# EAGLE design CPN v1 (EAGLE 9.5.0)
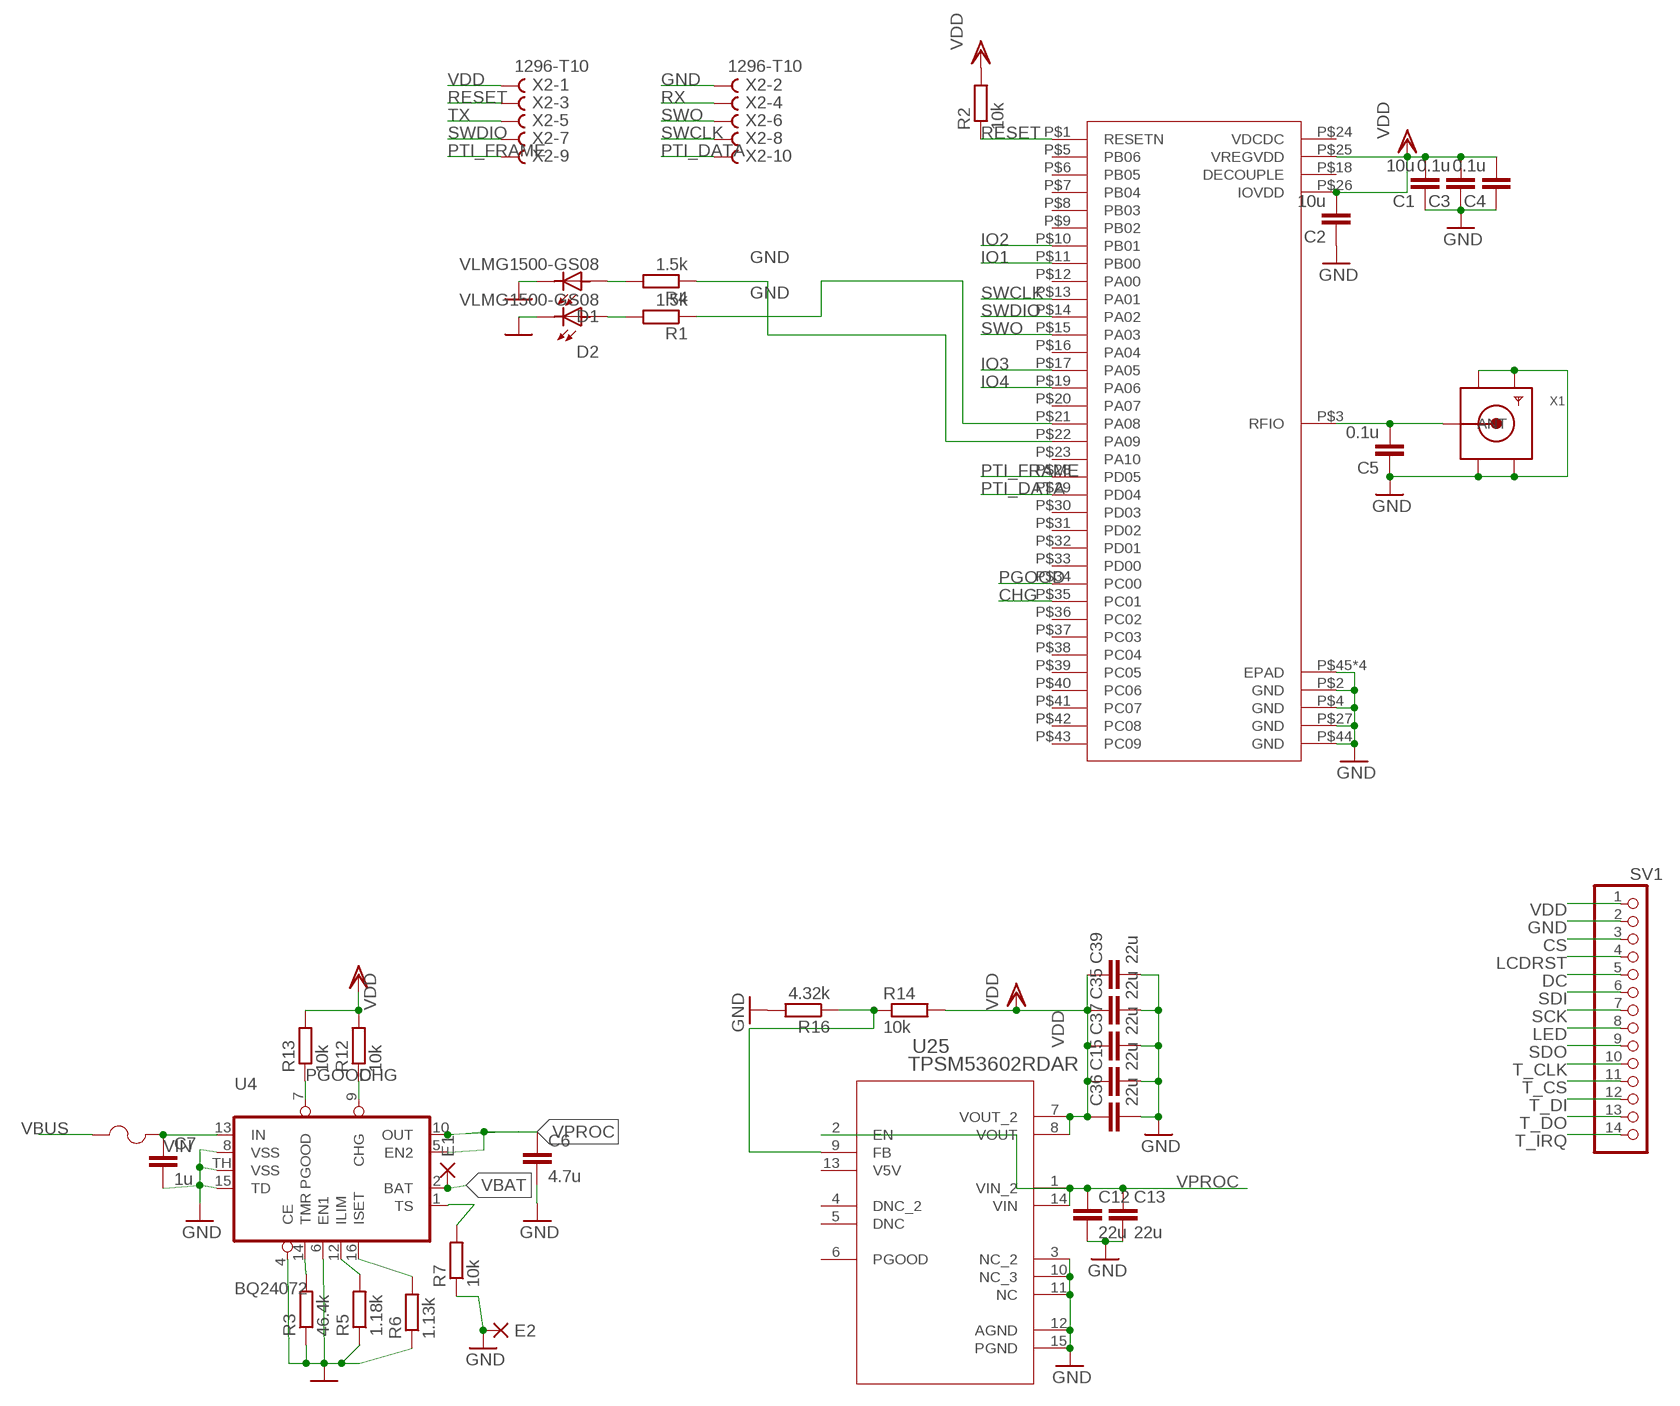
[diagram p0: schematic, sheet 1, part 1 of 2]
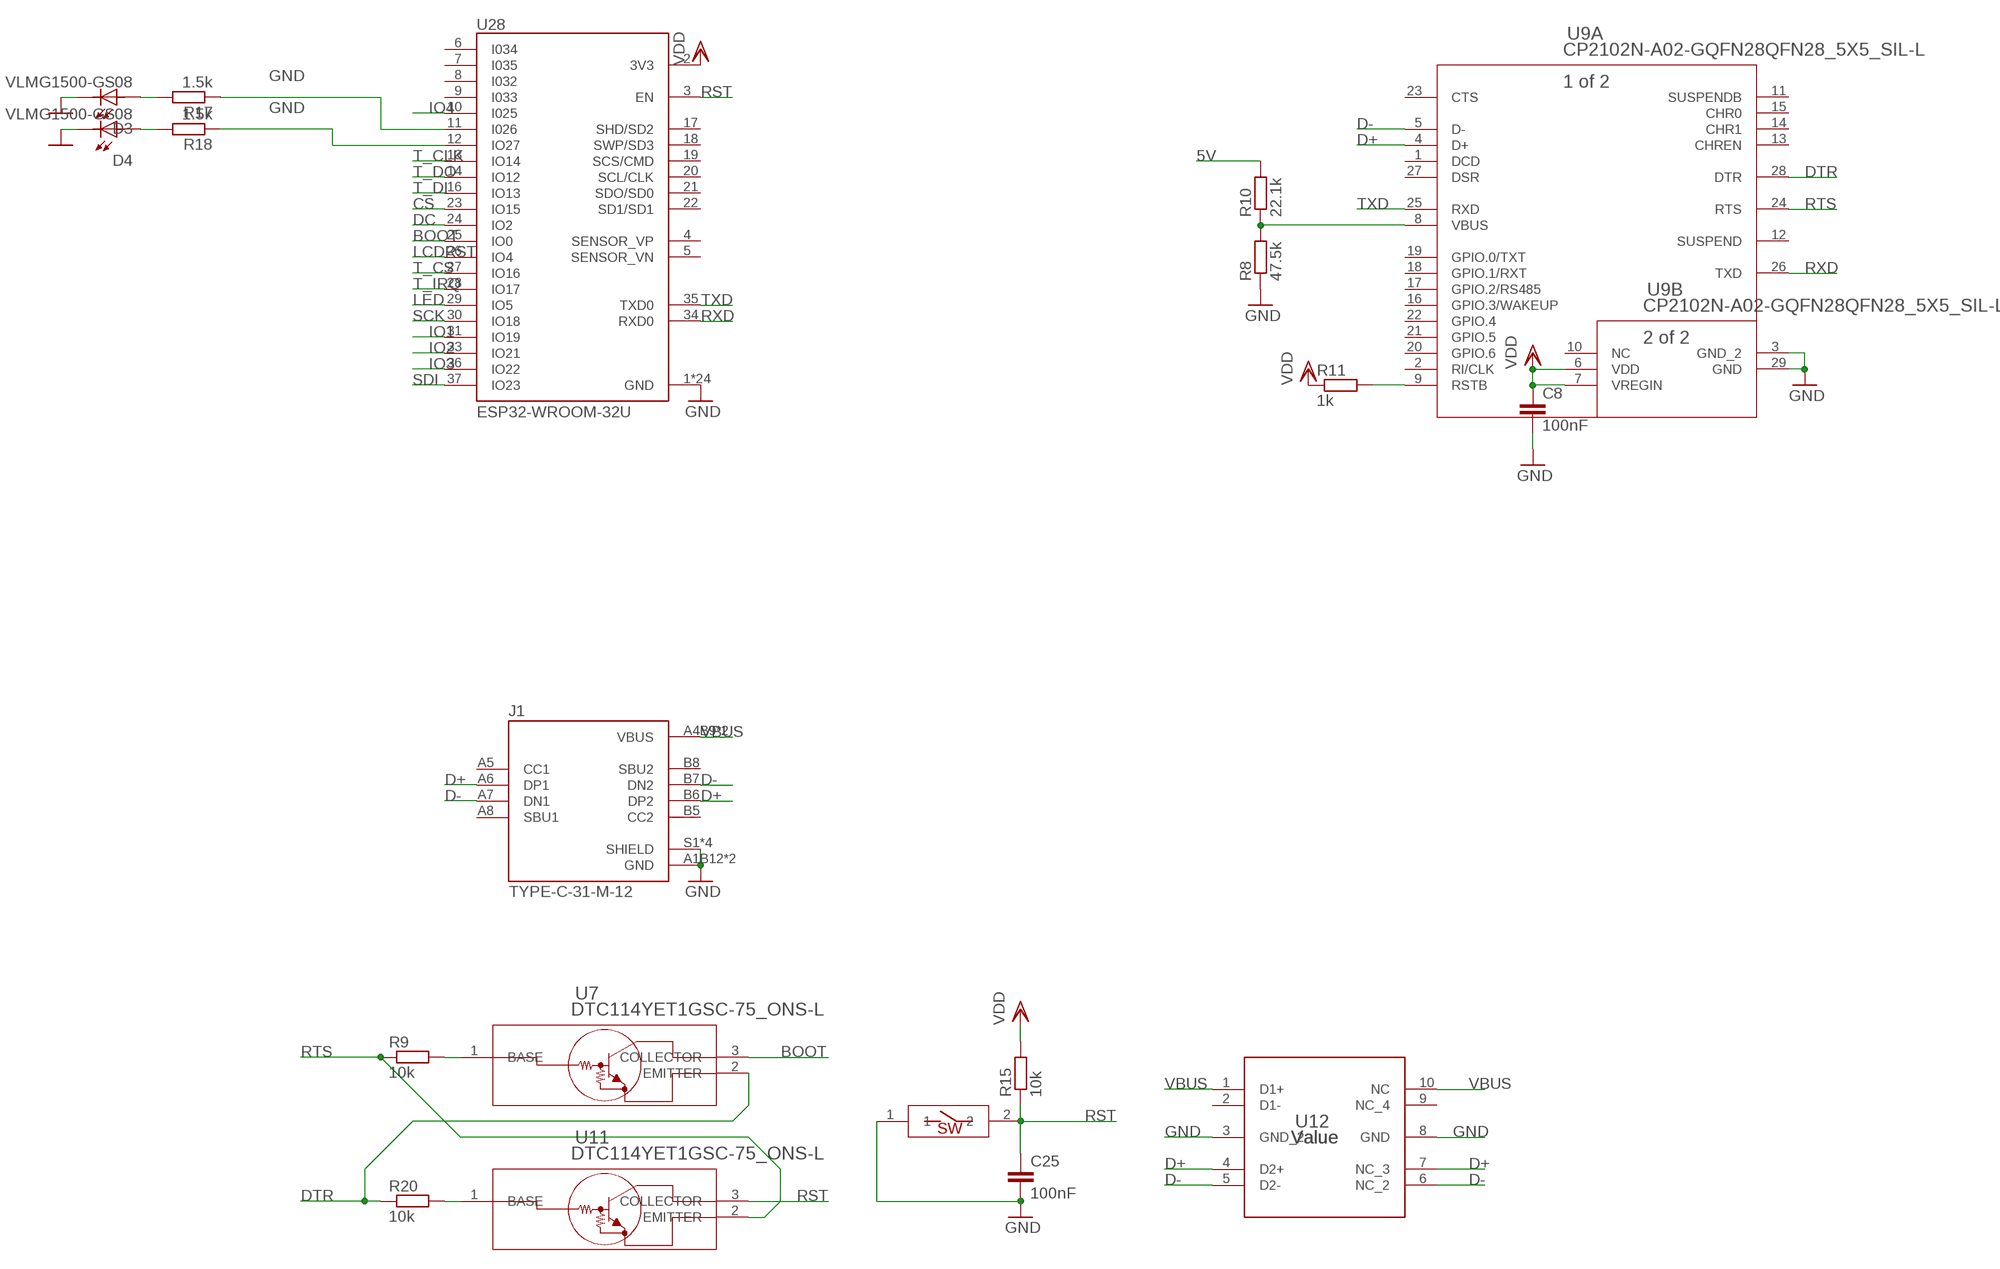
[diagram p1: schematic, sheet 1, part 2 of 2]

## Parts
C1  10u  CC0603R  [C0603R]
C2  10u  CC0603R  [C0603R]
C3  0.1u  CC0402  [C0402]
C4  0.1u  CC0402  [C0402]
C5  0.1u  CC0402  [C0402]
C6  4.7u  CC0402  [C0402]
C7  1u  CC0402  [C0402]
C8  100nF  CC0402  [C0402]
C12  22u  CC0603R  [C0603R]
C13  22u  CC0603R  [C0603R]
C15  22u  CC0603R  [C0603R]
C25  100nF  CC0402  [C0402]
C35  22u  CC0603R  [C0603R]
C36  22u  CC0603R  [C0603R]
C37  22u  CC0603R  [C0603R]
C39  22u  CC0603R  [C0603R]
D1  VLMG1500-GS08  [LEDC1005X35N]
D2  VLMG1500-GS08  [LEDC1005X35N]
D3  VLMG1500-GS08  [LEDC1005X35N]
D4  VLMG1500-GS08  [LEDC1005X35N]
E1  DPADS_PAD-0400-S  [DPADS_0400-S]
E2  DPADS_PAD-0400-S  [DPADS_0400-S]
F2  1210L050YR1210LSERIES_LTF-L  [1210LSERIES_LTF-L]
J1  TYPE-C-31-M-12  [HRO_TYPE-C-31-M-12]
R1  1.5k  RR0402  [R0402]
R2  10k  RR0402  [R0402]
R3  46.4k  RR0402  [R0402]
R4  1.5k  RR0402  [R0402]
R5  1.18k  RR0402  [R0402]
R6  1.13k  RR0402  [R0402]
R7  10k  RR0402  [R0402]
R8  47.5k  RR0402  [R0402]
R9  10k  RR0402  [R0402]
R10  22.1k  RR0402  [R0402]
R11  1k  RR0402  [R0402]
R12  10k  RR0402  [R0402]
R13  10k  RR0402  [R0402]
R14  10k  RR0402  [R0402]
R15  10k  RR0402  [R0402]
R16  4.32k  RR0402  [R0402]
R17  1.5k  RR0402  [R0402]
R18  1.5k  RR0402  [R0402]
R20  10k  RR0402  [R0402]
RESET  SMDSWITCH  [RESC4217X170]
SV1  PINHD-1X14  [1X14]
U4  BQ24072  [S-PVQFN-N16]
U7  DTC114YET1GSC-75_ONS-L  [SC-75_ONS-L]
U9  CP2102N-A02-GQFN28QFN28_5X5_SIL-L  [QFN28_5X5_SIL-L]
U11  DTC114YET1GSC-75_ONS-L  [SC-75_ONS-L]
U12  Value  ESD204DQAR  [DQA0010A]
U25  TPSM53602RDAR  [B3QFN15_RDA_TEX]
U28  ESP32-WROOM-32U  [XCVR_ESP32-WROOM-32U]
U$1  ZGM230S  [ZGM230S]
X1  SMACONNECTOR  [SMA90_DIP]
X2  1296-T10  [1296-10]

## Nets
5V: R10.2
BOOT: U7.3(COLLECTOR) U28.25(IO0)
CHG: R12.1 U4.9(CHG) U$1.P$35(PC01)
CS: SV1.3 U28.23(IO15)
D+: J1.A6(DP1) J1.B6(DP2) U9.4(A:D+) U12.4(D2+) U12.7(NC_3)
D-: J1.A7(DN1) J1.B7(DN2) U9.5(A:D-) U12.5(D2-) U12.6(NC_2)
DC: SV1.5 U28.24(IO2)
DTR: R20.1 U7.2(EMITTER) U9.28(A:DTR)
GND: C1.1 C2.1 C3.1 C4.1 C5.1 C6.2 C7.2 C8.2 C12.2 C13.2 C15.2 C25.2 C35.2 C36.2 C37.2 C39.2 D1.2 D2.2 D3.2 D4.2 E2.PAD(P) J1.A1B12(GND) J1.B1A12(GND) J1.S1(SHIELD) J1.S2(SHIELD) J1.S3(SHIELD) J1.S4(SHIELD) R3.1 R5.1 R6.1 R7.1 R8.1 R16.2 RESET.1 SV1.2 U4.4(CE) U4.6(EN1) U4.8(VSS) U4.15(TD) U4.TH(VSS) U9.3(B:GND_2) U9.29(B:GND) U12.3(GND_2) U12.8(GND) U25.3(NC_2) U25.10(NC_3) U25.11(NC) U25.12(AGND) U25.15(PGND) U28.1(GND) U28.15(GND) U28.38(GND) U28.G.1(GND) U28.G.2(GND) U28.G.4(GND) U28.G.5(GND) U28.G.6(GND) U28.G.7(GND) U28.G.8(GND) U28.G.9(GND) U28.G.10(GND) U28.G.11(GND) U28.G.12(GND) U28.G.13(GND) U28.G.14(GND) U28.G.15(GND) U28.G.16(GND) U28.G.17(GND) U28.G.18(GND) U28.G.19(GND) U28.G.20(GND) U28.G.21(GND) U28.G.22(GND) U$1.P$2(GND) U$1.P$4(GND) U$1.P$27(GND) U$1.P$44(GND) U$1.P$45(EPAD) U$1.P$46(EPAD) U$1.P$47(EPAD) U$1.P$48(EPAD) X1.GND1 X1.GND2 X1.GND3 X1.GND4 X2.2
IO1: U28.31(IO19) U$1.P$11(PB00)
IO2: U28.33(IO21) U$1.P$10(PB01)
IO3: U28.36(IO22) U$1.P$17(PA05)
IO4: U28.10(I025) U$1.P$19(PA06)
LCDRST: SV1.4 U28.26(IO4)
LED: SV1.8 U28.29(IO5)
N$1: D2.1 R1.2
N$2: R1.1 U$1.P$21(PA08)
N$3: R4.1 U$1.P$22(PA09)
N$4: R3.2 U4.14(TMR)
N$5: C5.2 U$1.P$3(RFIO) X1.ANTENNA(ANT)
N$6: R8.2 R10.1 U9.8(A:VBUS)
N$7: D1.1 R4.2
N$8: R11.2 U9.9(A:RSTB)
N$9: D3.1 R17.2
N$10: R5.2 U4.12(ILIM)
N$11: D4.1 R18.2
N$12: R6.2 U4.16(ISET)
N$13: R18.1 U28.12(IO27)
N$14: R17.1 U28.11(I026)
N$29: R20.2 U11.1(BASE)
N$30: R9.2 U7.1(BASE)
N$91: R14.1 R16.1 U25.9(FB)
PGOOD: R13.1 U4.7(PGOOD) U$1.P$34(PC00)
PTI_DATA: U$1.P$29(PD04) X2.10
PTI_FRAME: U$1.P$28(PD05) X2.9
RESET: R2.1 U$1.P$1(RESETN) X2.3
RST: C25.1 R15.1 RESET.2 U11.3(COLLECTOR) U28.3(EN)
RTS: R9.1 U9.24(A:RTS) U11.2(EMITTER)
RX: X2.4
RXD: U9.26(A:TXD) U28.34(RXD0)
SCK: SV1.7 U28.30(IO18)
SDI: SV1.6 U28.37(IO23)
SDO: SV1.9
SWCLK: U$1.P$13(PA01) X2.8
SWDIO: U$1.P$14(PA02) X2.7
SWO: U$1.P$15(PA03) X2.6
T_CLK: SV1.10 U28.13(IO14)
T_CS: SV1.11 U28.27(IO16)
T_DI: SV1.12 U28.16(IO13)
T_DO: SV1.13 U28.14(IO12)
T_IRQ: SV1.14 U28.28(IO17)
TS: R7.2 U4.1(TS)
TX: X2.5
TXD: U9.25(A:RXD) U28.35(TXD0)
VBAT: E1.PAD(P) U4.2(BAT)
VBUS: F2.1 J1.A4B9(VBUS) J1.B4A9(VBUS) U12.1(D1+) U12.10(NC)
VDD: C1.2 C2.2 C3.2 C4.2 C8.1 C15.1 C35.1 C36.1 C37.1 C39.1 R2.2 R11.1 R12.2 R13.2 R14.2 R15.2 SV1.1 U9.6(B:VDD) U9.7(B:VREGIN) U25.7(VOUT_2) U25.8(VOUT) U28.2(3V3) U$1.P$25(VREGVDD) U$1.P$26(IOVDD) X2.1
VIN: C7.1 F2.2 U4.13(IN)
VPROC [NCLS3V7]: C6.1 C12.1 C13.1 U4.5(EN2) U4.10(OUT) U25.1(VIN_2) U25.2(EN) U25.14(VIN)
Unconnected: J1.A5(CC1) J1.A8(SBU1) J1.B5(CC2) J1.B8(SBU2) U9.1(A:DCD) U9.2(A:RI/CLK) U9.10(B:NC) U9.11(A:SUSPENDB) U9.12(A:SUSPEND) U9.13(A:CHREN) U9.14(A:CHR1) U9.15(A:CHR0) U9.16(A:GPIO.3/WAKEUP) U9.17(A:GPIO.2/RS485) U9.18(A:GPIO.1/RXT) U9.19(A:GPIO.0/TXT) U9.20(A:GPIO.6) U9.21(A:GPIO.5) U9.22(A:GPIO.4) U9.23(A:CTS) U9.27(A:DSR) U12.2(D1-) U12.9(NC_4) U25.4(DNC_2) U25.5(DNC) U25.6(PGOOD) U25.13(V5V) U28.4(SENSOR_VP) U28.5(SENSOR_VN) U28.6(I034) U28.7(I035) U28.8(I032) U28.9(I033) U28.17(SHD/SD2) U28.18(SWP/SD3) U28.19(SCS/CMD) U28.20(SCL/CLK) U28.21(SDO/SD0) U28.22(SD1/SD1) U$1.P$5(PB06) U$1.P$6(PB05) U$1.P$7(PB04) U$1.P$8(PB03) U$1.P$9(PB02) U$1.P$12(PA00) U$1.P$16(PA04) U$1.P$18(DECOUPLE) U$1.P$20(PA07) U$1.P$23(PA10) U$1.P$24(VDCDC) U$1.P$30(PD03) U$1.P$31(PD02) U$1.P$32(PD01) U$1.P$33(PD00) U$1.P$36(PC02) U$1.P$37(PC03) U$1.P$38(PC04) U$1.P$39(PC05) U$1.P$40(PC06) U$1.P$41(PC07) U$1.P$42(PC08) U$1.P$43(PC09)

## Library data of the parts
C1 C2 C12 C13 C15 C35-C37 C39 = eagle-ltspice:C: CAPACITOR, European symbol
C3-C8 C25 = eagle-ltspice:C: CAPACITOR, European symbol; SPICEMODEL: NONE; SPICEPREFIX: C
D1-D4 = VLMG1500-GS08:VLMG1500-GS08: 0402 GREEN 571nm 35MCD 65° Rectangle with Flat Top SMT LED; AVAILABILITY: Unavailable; DESCRIPTION: 0402 GREEN 571nm 35MCD 65° Rectangle with Flat Top SMT LED; MF: Vishay; MP: VLMG1500-GS08; PACKAGE: 0402 Vishay; PRICE: None
E1 E2 = 52101-101-REV-A_v16:DPADS_PAD: WIRE PAD Standard US Drill Sizes and SMD pads; BOM: EXCLUDE
F2 = 1210 FUSE:1210L050YR; BUILT_BY: EMA_UL_Team; MANUFACTURER_PART_NUMBER: 1210L050YR; SOURCELIBRARY: LittleFuse_2015-04-13; VENDOR: Littelfuse Inc
J1 = TYPE-C-31-M-12:TYPE-C-31-M-12: USB Connectors 24 Receptacle 1 8.94*7.3mm RoHS Check prices <https://pricing.snapeda.com/parts/TYPE-C-31-M-12/HRO%20Electronics%20Co.%2C%20Ltd./view-part?ref=eda>; AVAILABILITY: Not in stock; DESCRIPTION: USB Connectors 24 Receptacle 1 8.94*7.3mm RoHS; MF: HRO Electronics Co., Ltd.; MP: TYPE-C-31-M-12; PACKAGE: Package; PRICE: None
R1-R18 R20 = eagle-ltspice:R: RESISTOR, European symbol; SPICEMODEL: NONE; SPICEPREFIX: R
RESET = SMD SWITCH:SMDSWITCH
SV1 = adafruit:PINHD-1X14: PIN HEADER
U4 = Simplex-ICs:BQ24072: TI BQ24072 - Li battery charger and power path management ic
U7 U11 = DTC114YET1G:DTC114YET1G; BUILT_BY: EMA_Justin; COPYRIGHT: Copyright (C) 2018 Accelerated Designs. All rights reserved; DATASHEET: https://www.onsemi.com/pub/Collateral/DTC114Y-D.PDF; MANUFACTURER_PART_NUMBER: DTC114YET1G; SOURCELIBRARY: ON_Semiconductor_2020-01-13; VENDOR: ON Semiconductor
U9 = CP2102N:CP2102N-A02-GQFN28; BUILT_BY: EMA_Cory; COPYRIGHT: Copyright (C) 2018 Accelerated Designs. All rights reserved; DATASHEET: https://www.silabs.com/documents/public/data-sheets/cp2102n-datasheet.pdf; MANUFACTURER_PART_NUMBER: CP2102N-A02-GQFN28; SOURCELIBRARY: Silicon_Labs_2020-02-14; VENDOR: Silicon Labs
U12 = ESD204DQAR:ESD204DQAR; MANUFACTURER: Texas Instruments; PARTNUMBER: ESD204DQAR; REFDES: RefDes; TYPE: TYPE
U25 = TPSM53602:TPSM53602RDAR; BUILT_BY: EMA_Cory; COPYRIGHT: Copyright (C) 2018 Accelerated Designs. All rights reserved; DATASHEET: https://www.ti.com/lit/ds/symlink/tpsm53602.pdf?ts=1593032137197&ref_url=https%253A%252F%252Fwww.ti.com%252Fstore%252Fti%252Fen%252Fp%252Fproduct%252F%253Fp%253DTPSM53602RDAR; MANUFACTURER_PART_NUMBER: TPSM53602RDAR; SOURCELIBRARY: TI_2020-06-27; VENDOR: Texas Instruments
U28 = ESP32-WROOM-32U:ESP32-WROOM-32U: Wi-Fi/BT BLE Module ESP32-D0WD SPI Flash UART U.FL Conn. Check prices <https://pricing.snapeda.com/parts/ESP32-WROOM-32U/Espressif%20Systems/view-part?ref=eda>; AVAILABILITY: In Stock; DESCRIPTION: Bluetooth, WiFi 802.11b/g/n, Bluetooth v4.2 +EDR, Class 1, 2 and 3 Transceiver Module 2.4GHz ~ 2.5GHz Antenna Not Included, U.FL Surface Mount; MF: Espressif Systems; MP: ESP32-WROOM-32U; PACKAGE: Module Espressif Systems; PRICE: None; PURCHASE-URL: https://pricing.snapeda.com/search/part/ESP32-WROOM-32U/?ref=eda
U$1 = ZGM230S:ZGM230S
X1 = adafruit:SMACONNECTOR: SMA Connector 90° DIP SMA Connector, 50 Ohm (4UConnector: 07259)
X2 = con-leotronics:1296-T10: 1.27mm SINGLE ROW FEMALE SOCKET Source: http://www.leotronics.co.uk/Conexcon/Data%20Sheets/sec.%20A/1296ing.pdf; OC_FARNELL: unknown; OC_NEWARK: unknown

## Net classes
2 NCLS3V7: width 0.178 mm, drill 0.178 mm, clearance 0.178 mm

## Board
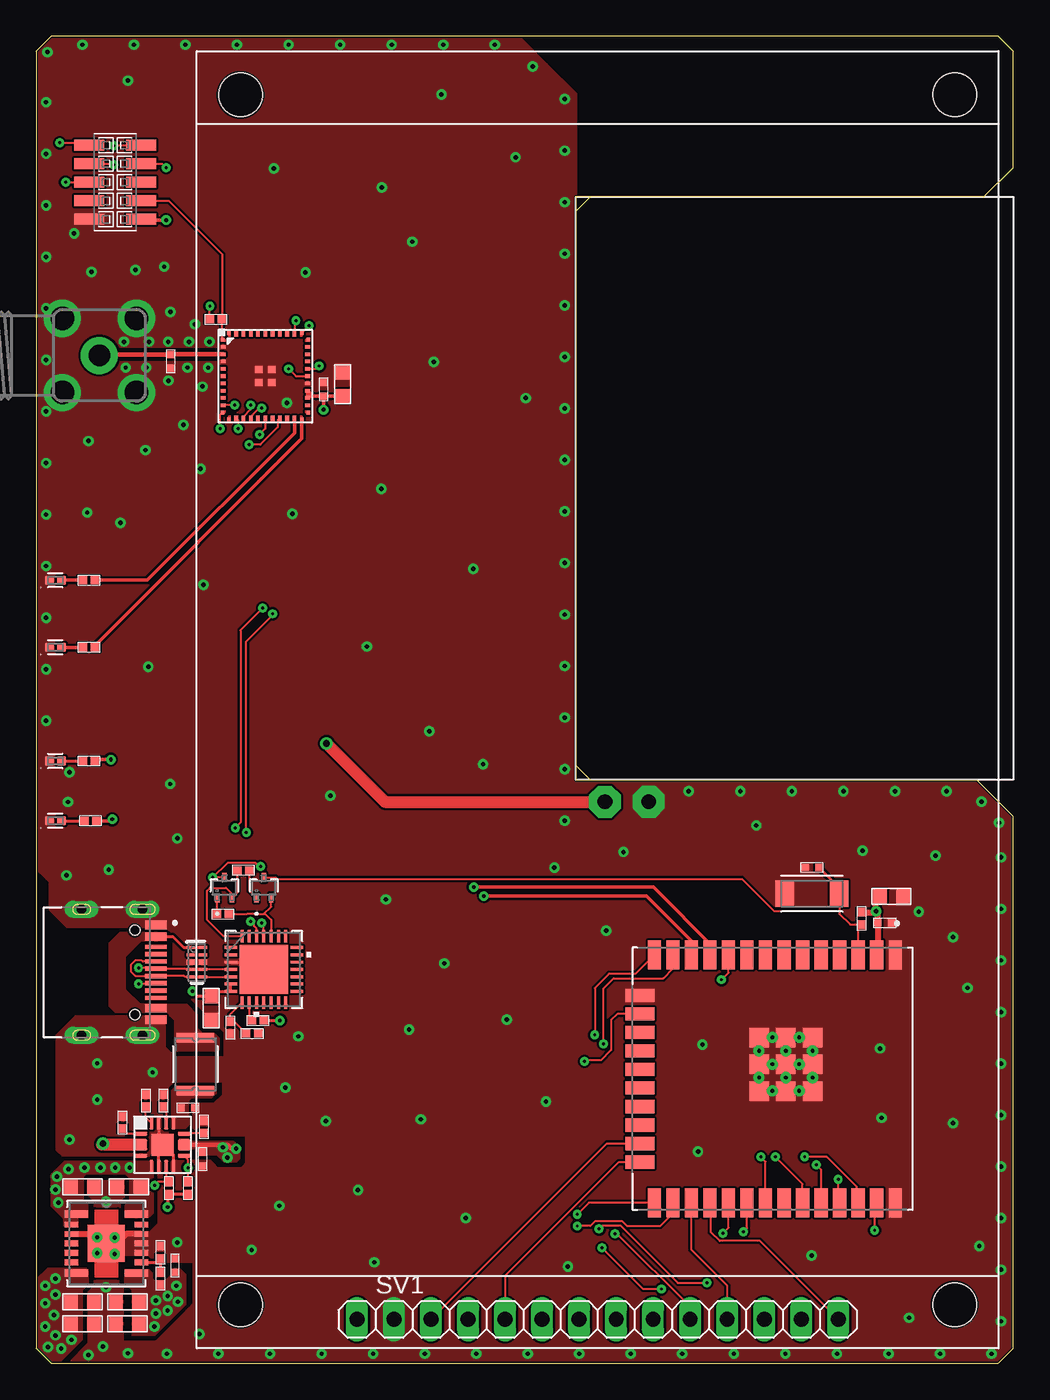
[diagram p2: board, top side]
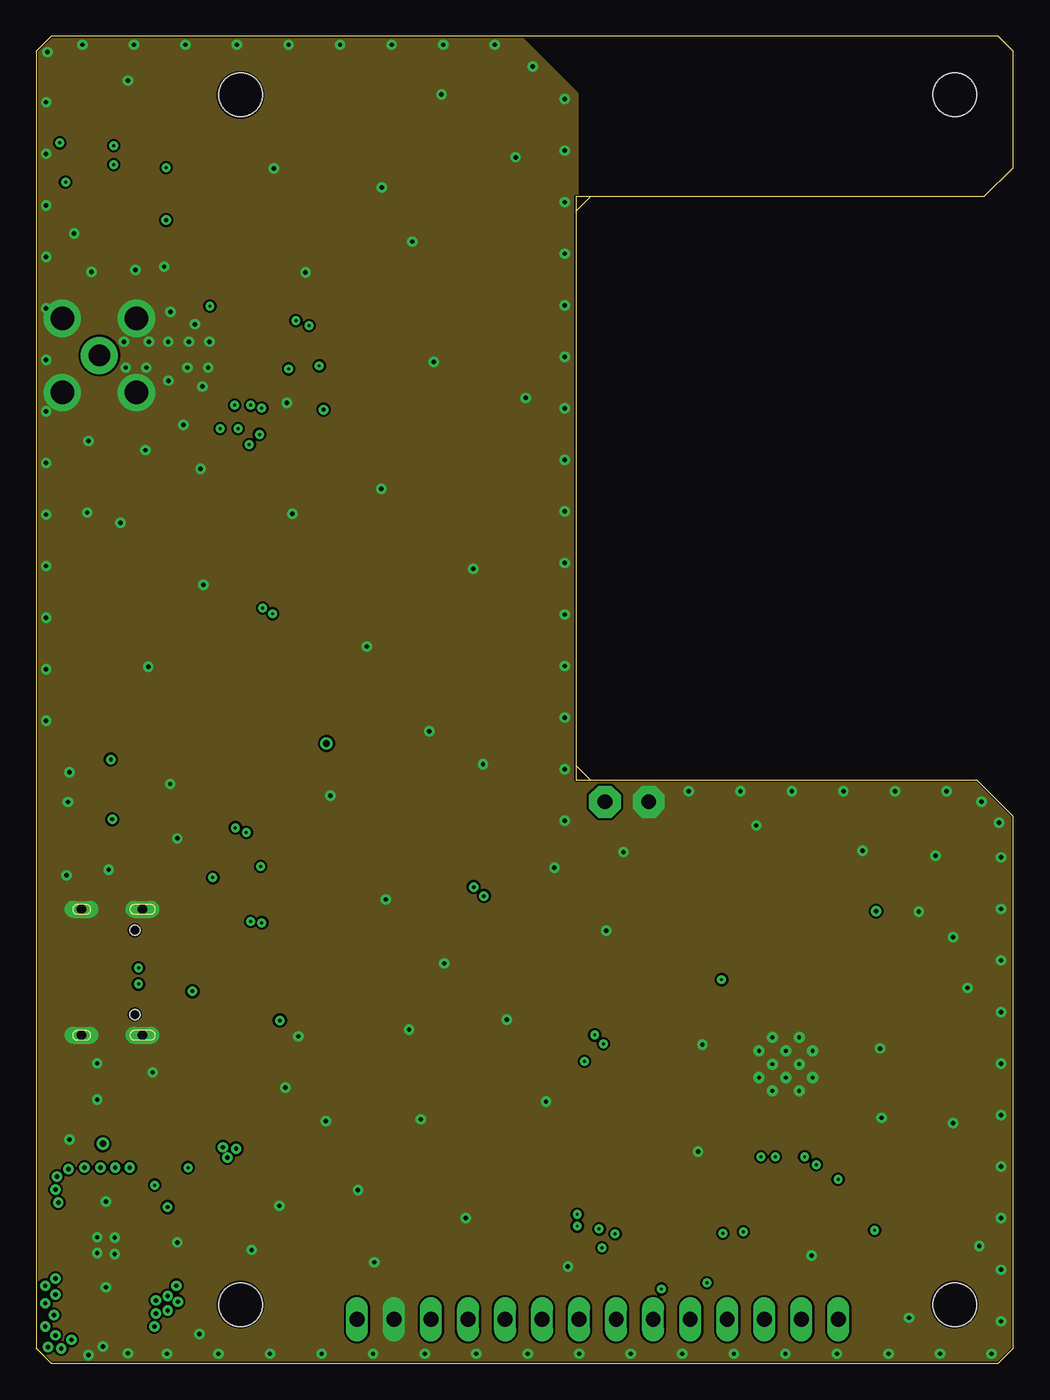
[diagram p3: board, inner layer Route2]
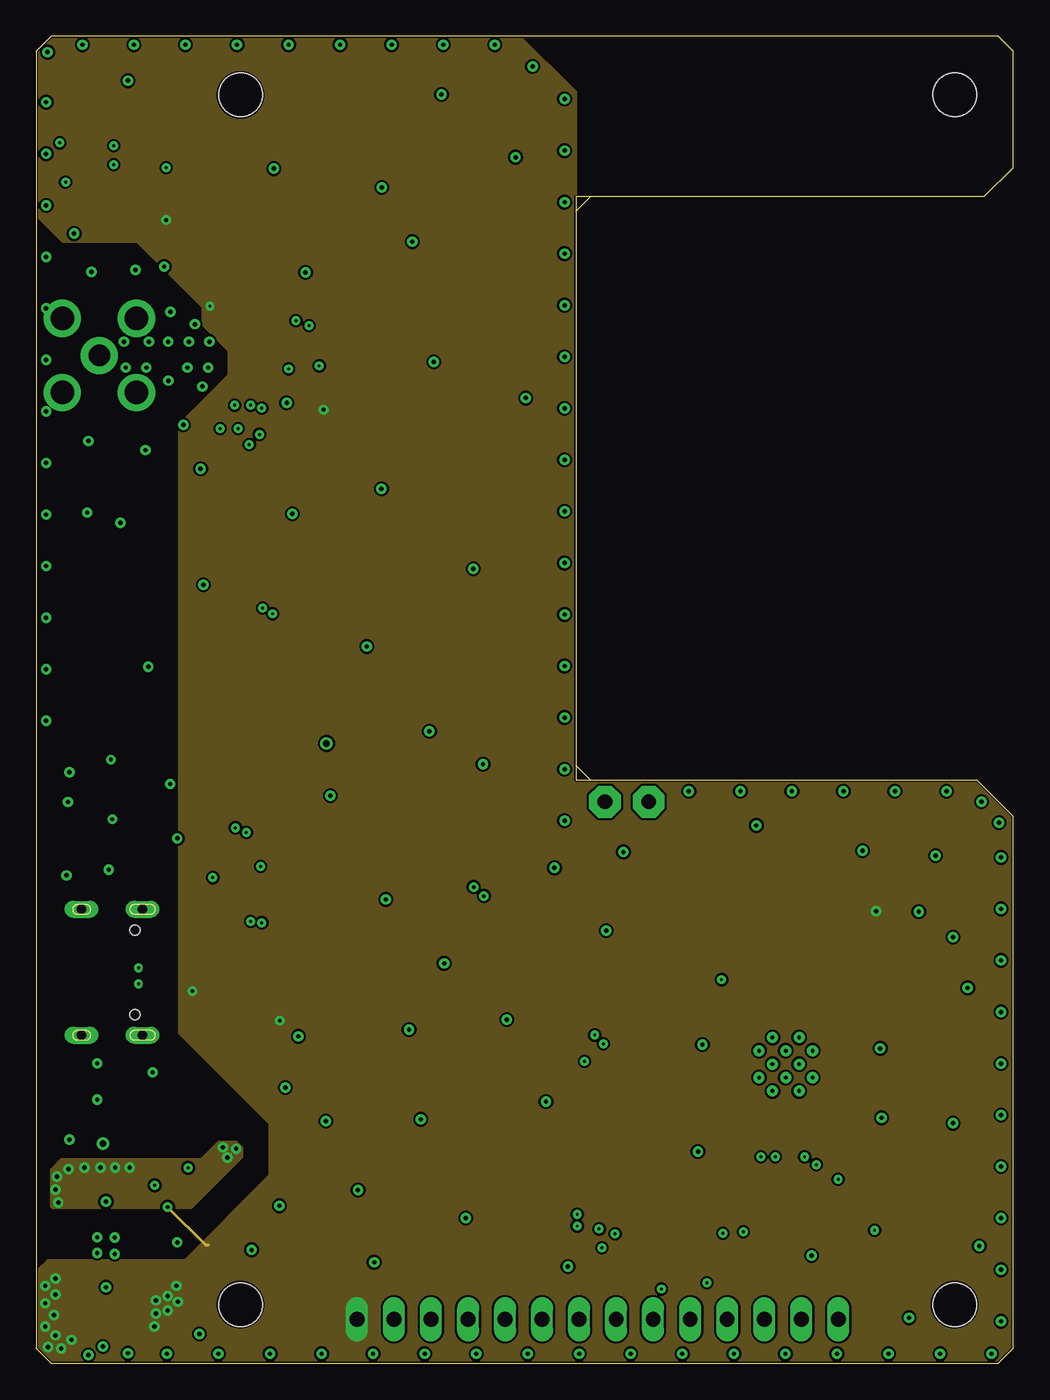
[diagram p4: board, inner layer Route15]
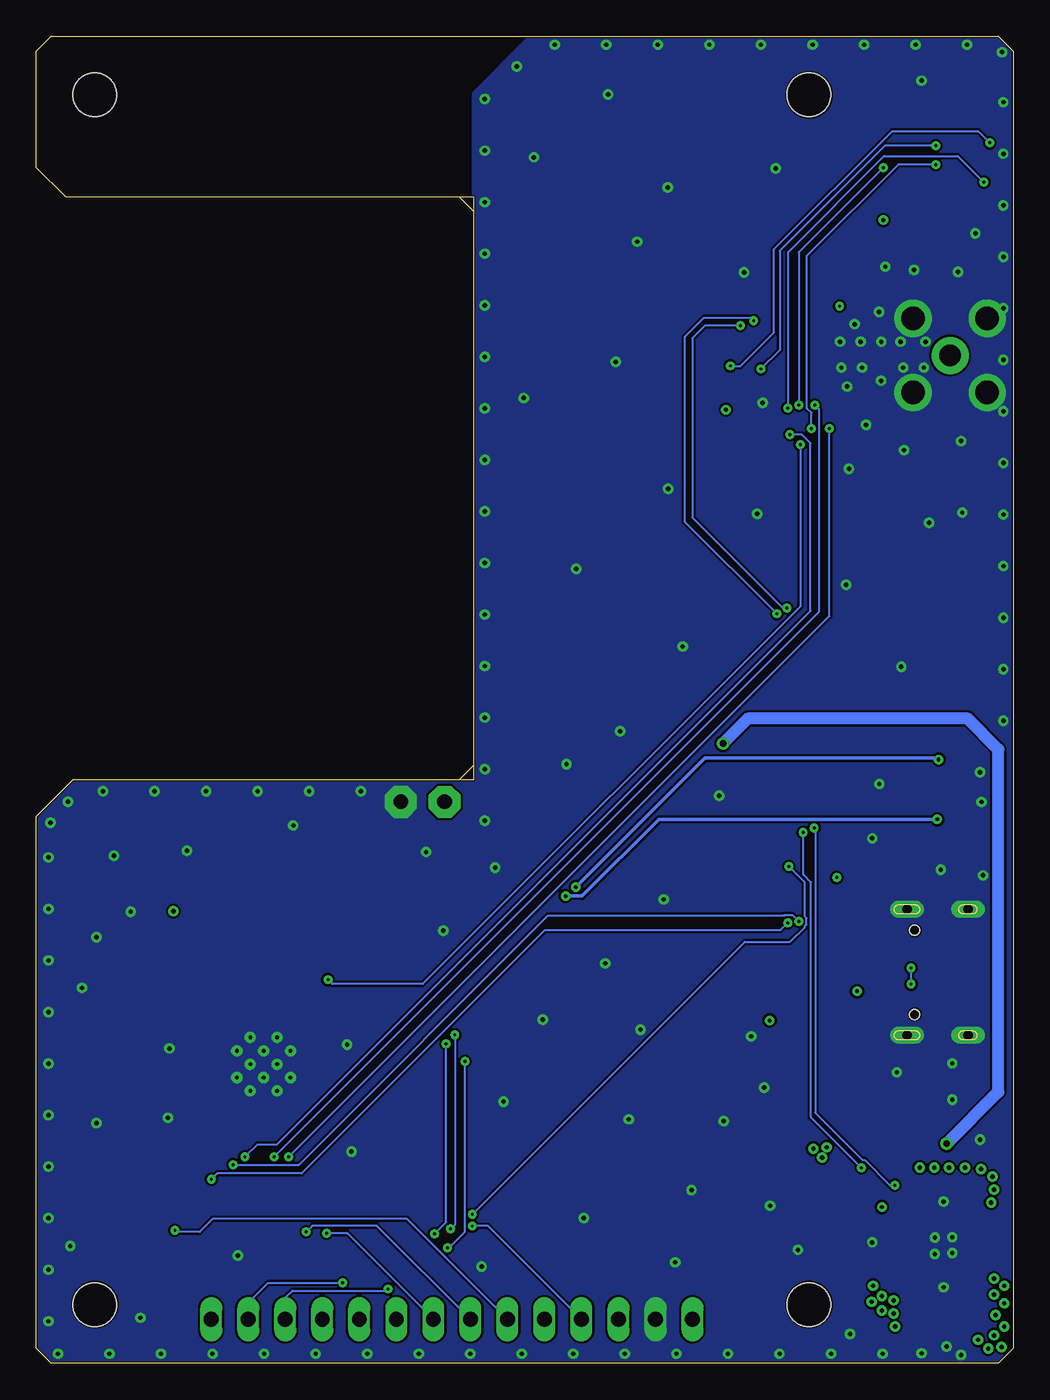
[diagram p5: board, bottom side, seen from below]

Size 67 x 91 mm. Coordinates in mm from the lower left corner, seen from the top.
Outline: 38,80 65,80 67,82 67,90 66,91 1,91 0,90 0,1 1,0 66,0 67,1 67,37.5 64.5,40 38,40
Outline: 38,80 37,80 37,79
Outline: 37,79 37,41
Outline: 37,41 37,40 38,40
Outline: 38,40 37,41
Outline: 37,79 38,80
Copper layers (1+2*15+16): Top 0.035mm / dielectric 1.5mm / Route2 0.035mm / dielectric 0.15mm / Route15 0.035mm / dielectric 0.2mm / Bottom 0.035mm
Design rules "default *": minimum track width 5mil, minimum drill 0.2mm, track to track 6mil, track to pad 6mil, pad to pad 6mil, via to via 6mil, smd to smd 6mil, copper to edge 5mil, drill to drill 6mil, minimum pad ring 10mil, minimum via ring 8mil, stop-mask expansion 0mil, vias tented up to drill 40mil, thermal gap 0mil
Holes 3 mm at 63,4 14,4 63,87 14,87
tRestrict: 2 lines

### Footprints (pad centres in the part's own frame; a part is rotated, then mirrored left to right if it is on the bottom)
C0603R = smd 0.95 x 0.95: 1 -0.85,0; 2 0.75,0
C0402 = smd 0.5 x 0.5: 1 -0.475,0; 2 0.475,0
LEDC1005X35N = smd 0.59 x 0.61: 1 -0.415,0; 2 0.415,0
DPADS_0400-S = drill 1.016 pad 2.184 octagon: PAD 0,0
1210LSERIES_LTF-L = smd 0.635 x 2.591: 1 -1.816,0; 2 1.816,0
HRO_TYPE-C-31-M-12 = smd 0.6 x 1.45: A1B12 -3.25,5.095; A4B9 -2.45,5.095; B1A12 3.25,5.095; B4A9 2.45,5.095 | smd 0.3 x 1.45: A5 -1.25,5.095; A6 -0.25,5.095; A7 0.25,5.095; A8 1.25,5.095; B5 1.75,5.095; B6 0.75,5.095; B7 -0.75,5.095; B8 -1.75,5.095 | drill 0.65 pad 1.05 long: S1 -4.32,4.18; S2 4.32,4.18; S3 -4.32,0; S4 4.32,0 | hole 0.7: -2.89,3.65; 2.89,3.65
R0402 = smd 0.6 x 0.55: 1 -0.425,0; 2 0.425,0
RESC4217X170 = smd 1.254 x 1.829: 1 -1.875,0; 2 1.875,0
1X14 = drill 1.016 long: 1 -16.51,0; 2 -13.97,0; 3 -11.43,0; 4 -8.89,0; 5 -6.35,0; 6 -3.81,0; 7 -1.27,0; 8 1.27,0; 9 3.81,0; 10 6.35,0; 11 8.89,0; 12 11.43,0; 13 13.97,0; 14 16.51,0
S-PVQFN-N16 = smd 0.85 x 0.28: 1 -0.725,2.225; 4 -0.725,0.725; 9 2.225,0.725; 12 2.225,2.225 | smd 0.85 x 0.78: 2 -0.725,1.475; 10 2.225,1.475 | smd 0.28 x 0.85: 5 0,0; 6 0.5,0; 7 1,0; 8 1.5,0; 13 1.5,2.95; 14 1,2.95; 15 0.5,2.95; 16 0,2.95 | smd 1.5 x 1.5: TH 0.75,1.475
SC-75_ONS-L = smd 0.305 x 0.61: 1 -0.5,-0.699; 2 0.5,-0.699; 3 0,0.699
QFN28_5X5_SIL-L = smd 0.864 x 0.203: 1 -2.273,1.5; 2 -2.273,1; 3 -2.273,0.5; 4 -2.273,0; 5 -2.273,-0.5; 6 -2.273,-1; 7 -2.273,-1.5; 15 2.273,-1.5; 16 2.273,-1; 17 2.273,-0.5; 18 2.273,0; 19 2.273,0.5; 20 2.273,1; 21 2.273,1.5 | smd 0.203 x 0.864: 8 -1.5,-2.273; 9 -1,-2.273; 10 -0.5,-2.273; 11 0,-2.273; 12 0.5,-2.273; 13 1,-2.273; 14 1.5,-2.273; 22 1.5,2.273; 23 1,2.273; 24 0.5,2.273; 25 0,2.273; 26 -0.5,2.273; 27 -1,2.273; 28 -1.5,2.273 | smd 3.353 x 3.353: 29 0,0
DQA0010A = smd 0.565 x 0.2: 1 -0.417,1; 2 -0.417,0.5; 4 -0.417,-0.5; 5 -0.417,-1; 6 0.417,-1; 7 0.417,-0.5; 9 0.417,0.5; 10 0.417,1 | smd 0.565 x 0.4: 3 -0.417,0; 8 0.417,0
B3QFN15_RDA_TEX = smd 1.6 x 0.508: 1 -2.057,2.025; 7 -2.057,-2.025; 8 2.057,-2.025; 14 2.057,2.025 | smd 0.914 x 0.406: 2 -2.4,1.3; 3 -2.4,0.65; 4 -2.4,0; 5 -2.4,-0.65; 6 -2.4,-1.3; 9 2.4,-1.3; 10 2.4,-0.65; 11 2.4,0; 12 2.4,0.65; 13 2.4,1.3 | smd 2.54 x 2.54: 15 0,0
XCVR_ESP32-WROOM-32U = smd 2 x 0.9: 1 -8.5,8.41; 2 -8.5,7.14; 3 -8.5,5.87; 4 -8.5,4.6; 5 -8.5,3.33; 6 -8.5,2.06; 7 -8.5,0.79; 8 -8.5,-0.48; 9 -8.5,-1.75; 10 -8.5,-3.02; 11 -8.5,-4.29; 12 -8.5,-5.56; 13 -8.5,-6.83; 14 -8.5,-8.1; 25 8.5,-8.1; 26 8.5,-6.83; 27 8.5,-5.56; 28 8.5,-4.29; 29 8.5,-3.02; 30 8.5,-1.75; 31 8.5,-0.48; 32 8.5,0.79; 33 8.5,2.06; 34 8.5,3.33; 35 8.5,4.6; 36 8.5,5.87; 37 8.5,7.14; 38 8.5,8.41 | smd 0.9 x 2: 15 -5.715,-9.1; 16 -4.445,-9.1; 17 -3.175,-9.1; 18 -1.905,-9.1; 19 -0.635,-9.1; 20 0.635,-9.1; 21 1.905,-9.1; 22 3.175,-9.1; 23 4.445,-9.1; 24 5.715,-9.1 | smd 1.33 x 1.33: G.1 0.835,2.745; G.2 -1,2.745; G.4 -2.835,2.745; G.5 0.835,0.91; G.6 -1,0.91; G.7 -2.835,0.91; G.8 0.835,-0.925; G.9 -1,-0.925; G.10 -2.835,-0.925 | drill 0.254: G.11 -0.083,2.745; G.12 -1.917,2.745; G.13 0.835,1.827; G.14 -1,1.827; G.15 -2.835,1.827; G.16 -0.083,0.91; G.17 -1.917,0.91; G.18 0.835,-0.007; G.19 -1,-0.007; G.20 -2.835,-0.007; G.21 -0.083,-0.925; G.22 -1.917,-0.925
ZGM230S = smd 0.24 x 0.25: P$1 0.045,0; P$11 0.05,-5; P$23 5.955,-5; P$33 5.955,0 | smd 0.35 x 0.25: P$2 0.1,-0.5; P$3 0.1,-1; P$4 0.1,-1.5; P$5 0.1,-2; P$6 0.1,-2.5; P$7 0.1,-3; P$8 0.1,-3.5; P$9 0.1,-4; P$10 0.1,-4.5; P$24 5.9,-4.5; P$25 5.9,-4; P$26 5.9,-3.5; P$27 5.9,-3; P$28 5.9,-2.5; P$29 5.9,-2; P$30 5.9,-1.5; P$31 5.9,-1; P$32 5.9,-0.5 | smd 0.25 x 0.24: P$12 0.5,-5.455; P$22 5.5,-5.455; P$34 5.5,0.455; P$44 0.5,0.455 | smd 0.25 x 0.35: P$13 1,-5.4; P$14 1.5,-5.4; P$15 2,-5.4; P$16 2.5,-5.4; P$17 3,-5.4; P$18 3.5,-5.4; P$19 4,-5.4; P$20 4.5,-5.4; P$21 5,-5.4; P$35 5,0.4; P$36 4.5,0.4; P$37 4,0.4; P$38 3.5,0.4; P$39 3,0.4; P$40 2.5,0.4; P$41 2,0.4; P$42 1.5,0.4; P$43 1,0.4 | smd 0.5 x 0.5: P$45 2.55,-2.95; P$46 3.45,-2.95; P$47 3.45,-2.05; P$48 2.55,-2.05
SMA90_DIP = drill 1.5 pad 2.54: ANTENNA 0,0 | drill 1.6 pad 2.54: GND1 -2.54,2.54; GND2 2.54,2.54; GND3 -2.54,-2.54; GND4 2.54,-2.54
1296-10 = smd 0.76 x 2.05: 1 -2.54,-1.78; 2 -2.54,1.78; 3 -1.27,-1.78; 4 -1.27,1.78; 5 0,-1.78; 6 0,1.78; 7 1.27,-1.78; 8 1.27,1.78; 9 2.54,-1.78; 10 2.54,1.78

### Placement (x,y rotation side)
C1  21,67.1 270 top
C2  58.6,32 180 top
C3  19.7,66.8 270 top
C4  58.2,30.2 180 top
C5  9.2,68.7 90 top
C6  11.4,14 270 top
C7  10.4,17.5 0 top
C8  9.5,6.7 90 top
C12  6.3,12.1 180 top
C13  3.2,12.1 0 top
C15  6.2,4.2 180 top
C25  53.2,34 180 top
C35  3.2,4.2 0 top
C36  12,24.3 270 top
C37  3.2,2.7 0 top
C39  6.2,2.7 180 top
D1  1.3,49.1 180 top
D2  1.3,53.7 180 top
D3  1.3,41.3 180 top
D4  1.3,37.2 180 top
E1  39,38.5 90 top
E2  42,38.5 90 top
F2  10.9,20.5 270 top
J1  3.1,26.8 270 top
R1  3.6,53.7 180 top
R2  12.3,71.6 180 top
R3  8.7,18 270 top
R4  3.6,49.1 180 top
R5  11.5,16.2 270 top
R6  7.5,18 270 top
R7  5.9,16.5 270 top
R8  13.3,23 90 top
R9  12.8,30.8 180 top
R10  14.8,22.6 0 top
R11  15.2,23.5 180 top
R12  10.4,12 270 top
R13  9.1,12 270 top
R14  8.5,5.8 270 top
R15  56.6,30.5 90 top
R16  8.5,7.6 90 top
R17  3.6,41.3 180 top
R18  3.7,37.2 180 top
R20  14.2,33.8 0 top
RESET  53.2,32.2 0 top
SV1  38.5,3 0 top
U4  7.9,13.5 0 top
U7  12.9,32.6 0 top
U9  15.6,27 0 top
U11  15.6,32.6 0 top
U12  11,27.5 0 top
U25  4.8,8.2 0 top
U28  50.5,19.5 270 top
U$1  12.7,70.2 0 top
X1  4.32,69.12 90 top
X2  5.4,81 90 top

### Tracks (layer width: path | path; a pad name or v marks a point on that pad's centre or on a via)
BOOT  (via drill 0.2)
  Top 0.15: U7.3 v12.1,33.3 | v12.1,33.3 | U28.25 37.9,11 v37.1,10.2 | v15.38,34.06 15.26,34.06 15.02,34.3 13.11,34.3 v12.1,33.3
  Bottom 0.15: v37.1,10.2 18.4,28.9 15.3,28.9 14.3,29.9 14.3,29.95 14.17,30.08 14.17,30.52 14.3,30.65 14.3,32.98 v15.38,34.06
CHG  (via drill 0.2)
  Top 0.127: v10.4,13.4 10.4,13.95 U4.9
  Top 0.15: R12.1 v10.4,13.4 | v14.4,36.4 14.4,49.5 16.2,51.3 v16.2,51.4 | v17.8,71.5 17.7,71.4 U$1.P$35
  Bottom 0.15: v10.4,13.4 13.87,16.87 13.87,32.97 14.4,33.51 v14.4,36.4 | v16.2,51.4 22.5,57.7 22.5,70.4 21.2,71.7 18,71.7 v17.8,71.5
CS
  Top 0.15: SV1.3 39.12,15.05 U28.23
D+  (via drill 0.2)
  Top 0.15: U12.4 10.28,27 10.23,27.05 J1.A6 8.14,27.1 v7,27.1 | U9.4 U12.7 | v7,26 7.05,26.05 J1.B6
  Top 0.2: U12.7 U12.4
  Bottom 0.15: v7,27.1 v7,26
D-
  Top 0.15: U12.5 10.18,26.5 10.13,26.55 J1.A7 8.14,26.5 7.5,26.5 7.43,26.57 6.78,26.57 6.47,26.88 6.47,27.32 6.78,27.63 7.22,27.63 7.3,27.55 J1.B7 | U12.6 U9.5 | U9.5
  Top 0.2: U12.5 U12.6
DC
  Top 0.15: SV1.5 32.15,6 39.94,13.79 U28.24
DTR
  Top 0.15: R20.1 13.78,32.28 13.55,32.05 | 13.55,32.05 U7.2 | U9.28 12.83,29.27 11.7,30.4 11.7,32.4 11.9,32.6 13,32.6 13.55,32.05
GND  (via drill 0.3)
  Top 0.2: U9.3 15.1,27.5 U9.29
  Top 0.203: U4.6 8.4,14.72 U4.TH 8.72,14.97 9.4,14.3 U4.8 | U4.15 8.4,15.6
  Top 0.406: U25.3 4.15,8.85 U25.15 5.5,8.2 6.2,8.9 7.15,8.9 U25.12
  other vias: 11.78,68.29 11.38,66.99 10.36,68.29 9.05,67.39 7.53,68.29 6.12,68.29 11.19,1.99 45.39,14.51 64.69,8.02 45.69,21.84 39.09,29.65 53.19,7.37 57.89,21.58 61.69,34.79 62.89,29.21 57.99,16.82 63.89,25.74 62.89,16.45 49.39,36.88 25.79,76.92 3.49,58.34 23.69,80.65 10.09,64.36 2.59,77.48 6.79,74.99 9.19,72.11 27.79,87.02 16.29,81.94 3.57,0.56 4.17,7.56 6.27,0.67 4.77,11.08 4.77,5.2 5.37,8.61 4.17,8.63 4.57,1.14 3.77,74.85 6.27,87.97 5.37,7.48 23.17,6.91 2.27,15.33 7.97,19.94 4.17,20.55 4.17,18.07 16.67,10.78 17.07,18.9 27.97,27.41 9.17,39.73 56.67,35.14 40.27,35.05 23.67,59.97 29.97,54.48 33.57,66.2 32.87,82.71 7.47,62.62 5.77,57.64 7.67,47.75 17.17,65.87 0.77,89.92 0.67,86.49 0.67,82.95 0.67,79.42 0.67,75.88 0.67,72.35 0.67,68.81 0.67,65.27 0.67,61.74 0.67,58.2 0.67,54.67 0.67,51.13 0.67,47.6 0.67,44.06 2.27,40.53 2.17,38.49 2.07,33.45 34.04,88.93 35.53,33.97 30.63,41.07 36.23,37.21 36.23,40.74 36.23,44.28 36.23,47.81 36.23,51.35 36.23,54.88 36.23,58.42 36.23,61.95 36.23,65.49 36.23,69.03 36.23,72.56 36.23,76.1 36.23,79.63 36.23,83.17 36.23,86.7 31.44,90.43 27.9,90.43 24.37,90.43 20.83,90.43 17.3,90.43 13.76,90.43 10.23,90.43 6.69,90.43 3.15,90.43 60.53,30.97 66.03,37.07 64.83,38.51 62.43,39.23 58.9,39.23 55.36,39.23 51.83,39.23 48.29,39.23 44.75,39.23 66.17,34.69 66.17,31.15 66.17,27.62 66.17,24.08 66.17,20.55 66.17,17.01 66.17,13.47 66.17,9.94 66.17,6.4 66.17,2.87 65.52,0.63 61.99,0.63 58.45,0.63 54.92,0.63 51.38,0.63 47.85,0.63 44.31,0.63 40.77,0.63 37.24,0.63 33.7,0.63 30.17,0.63 26.63,0.63 23.1,0.63 19.56,0.63 16.03,0.63 12.49,0.63 8.95,0.63 11.86,70.06 10.86,71.26 10.45,70.06 9.04,70.06 7.72,70.06 6.01,70.06 59.86,3.11 36.46,6.62 34.96,17.94 29.46,9.95 14.76,7.76 9.66,8.28 19.86,16.59 17.96,22.41 26.36,16.72 4.96,33.83 32.26,23.55 22.06,11.86 25.56,22.88 9.66,35.99 23.96,31.81 20.16,38.92 26.96,43.33 22.66,49.15 17.56,58.26 27.26,68.68 11.46,53.39 8.76,75.21 18.46,74.82 11.26,61.33 3.56,63.25
  pour Top: 4,10.5 4,11.1 3.6,11.5 3.6,12.5 6,12.5 6,11.4 5.7,11.1 5.7,10.6 5.6,10.5
  pour Top: 3.6,1.4 3.6,4.9 4,5.3 4,6.1 5.6,6.1 5.6,5.5 5.9,5.2 5.9,1.5 8.2,1.5 10.5,3.8 10.5,0 2.2,0
  pour Top: 5.8,8.3 6.5,9 7.8,9 8.4,9.6 8.4,13.9 11.9,13.9 12.6,13.2 12.6,7.7 11.8,6.9 8.2,6.9 7.7,7.4 6,7.4 5.8,7.6
  pour Top: 7.7,14.2 1.8,14.2 1.4,14.6 1.4,22.5 2.7,23.8 8.8,23.8 8.8,21.7 9.5,21 12.9,21 12.9,19.3 9.4,19.3 9,18.9 9,15.5
  pour Top: 10.8,16.1 10.8,17.8 12.2,17.8 12.8,18.4 12.8,21 16.2,21 16.4,20.8 16.4,17.4 14.6,15.6 11.3,15.6
  pour Top: 12.9,21 12.9,22.7 12.5,23.1 11.5,23.1 11.5,24.1 9.4,26.2 9.4,29.4 8.9,29.9 2.1,29.9 0.9,31.1 0.9,32.9 3,35 17,35 21.7,30.3 21.7,25.1 17.4,20.8 13.1,20.8
  pour Top: 10.4,3.7 10.8,4.1 10.8,4.7 10.8,12.1 12.1,13.4 14.1,13.4 14.2,13.5 14.4,13.7 14.4,15.7 14.4,19.4 19.6,24.6 19.6,31.6 16.5,34.7 2.9,34.7 1.2,33 0.9,33 0.7,33.2 0,33.9 0,43.6 0,90 0.9,90.9 33.2,90.9 35,89.1 37,87.1 37,77.8 37,41 37.9,40.1 64.3,40.1 67,37.4 67,1 66,0 10.7,0 10.3,0.4 10.3,3.6
  pour Route2: 0.1,90 1,90.9 33.3,90.9 37.1,87.1 37.1,86.1 37.1,40.8 37.9,40 64.5,40 67,37.5 67,1 66,0 1,0 0,1 0,89.9
  pour Bottom: 0,89.9 1,90.9 33.3,90.9 37.1,87.1 37.1,40.8 37.9,40 64.5,40 67,37.5 67,1 66,0 1,0 0,1
IO1  (via drill 0.2)
  Top 0.15: U28.31 50.02,13.82 v49.7,14.14 | v12.6,64.1 12.6,65.05 U$1.P$11
  Bottom 0.15: v49.7,14.14 12.6,51.24 v12.6,64.1
IO2  (via drill 0.2)
  Top 0.15: U28.33 52.56,12.28 v50.7,14.14 | v13.6,65.7 U$1.P$10
  Bottom 0.15: v50.7,14.14 13.3,51.54 13.3,65.4 v13.6,65.7
IO3  (via drill 0.2)
  Top 0.15: U28.36 56.28,11.09 56.28,12.07 54.21,14.14 v52.7,14.14 | U$1.P$17 15.7,64.1 v15.3,63.7
  Bottom 0.15: v52.7,14.14 51.84,15 50.5,15 13.9,51.6 13.9,63.1 14.5,63.7 v15.3,63.7
IO4  (via drill 0.2)
  Top 0.15: U$1.P$19 16.55,64.65 16.55,64.2 15.35,63 v14.6,63 | v47,26.3 47.48,26.78 U28.10
  Bottom 0.15: v14.6,63 14.6,51.9 40.5,26 46.7,26 v47,26.3
LCDRST  (via drill 0.2)
  Top 0.15: U28.26 43.8,10.87 43.8,10.4 42.8,9.4 40.53,9.4 40.2,9.73 38.33,9.73 38,9.4 v37.1,9.4
  Bottom 0.15: SV1.4 36.01,9.4 v37.1,9.4
LED  (via drill 0.2)
  Top 0.15: v47.1,8.9 47.48,9.28 U28.29
  Bottom 0.15: SV1.8 45.67,8.9 v47.1,8.9
N$1
  Top 0.254: D2.1 R1.2
N$2
  Top 0.254: R1.1 7.6,53.7 17.7,63.8 U$1.P$21
N$3
  Top 0.254: U$1.P$22 18.2,63.4 4.03,49.23 R4.1
N$4
  Top 0.15: R3.2 8.9,17.38 U4.14
N$5
  Top 0.305: 9.14,69.12 C5.2 | U$1.P$3 9.22,69.2 C5.2 | C5.2 4.38,69.17 X1.ANTENNA
N$6
  Top 0.127: U9.8 13.3,23.93 R8.2 13.55,23.43 R10.1
N$7
  Top 0.254: D1.1 R4.2
N$8
  Top 0.127: U9.9 14.6,23.68 R11.2
N$9
  Top 0.203: D3.1 R17.2
N$10
  Top 0.15: U4.12 10.18,15.78 R5.2
N$11
  Top 0.203: D4.1 R18.2
N$12
  Top 0.15: U4.16 7.5,16.85 R6.2
N$13  (via drill 0.25)
  Top 0.254: R18.1 5.1,37.2 v5.2,37.3 | v30.7,32.04 41.86,32.04 44.94,28.96 U28.12
  Bottom 0.254: v5.2,37.3 24.3,37.3 29.56,32.04 v30.7,32.04
N$14  (via drill 0.25)
  Top 0.254: U28.11 46.41,28 46.53,28.12 46.53,28.46 42.34,32.64 v30,32.64 | v5.1,41.4 4.12,41.4 R17.1
  Bottom 0.254: v30,32.64 21.14,41.5 5.2,41.5 v5.1,41.4
N$29
  Top 0.15: U11.1 14.62,32.38 R20.2
N$30
  Top 0.15: R9.2 12.4,30.82 U7.1
N$91
  Top 0.2: R16.1 8.5,7 | 8.5,7 R14.1 | U25.9 8.4,6.9 8.5,7
PGOOD  (via drill 0.2)
  Top 0.127: U4.7 8.9,12.62 R13.1
  Top 0.15: R13.1 8.33,12.43 v8.11,12.2 | U$1.P$34 18.7,71.16 v18.7,71.17 | v15.51,51.79 14,50.27 14,37.07 v13.64,36.72
  Bottom 0.15: v18.7,71.17 21.13,71.17 22,70.3 22,58 15.79,51.79 v15.51,51.79 | v8.11,12.2 8.45,12.2 10.18,13.93 10.33,13.93 11.3,14.9 13.56,17.16 13.56,36.64 v13.64,36.72
PTI_DATA  (via drill 0.2)
  Top 0.15: U$1.P$29 19.2,68.2 v19.4,68.4 | v1.6,83.7 3.46,83.7 X2.10
  Bottom 0.15: v19.4,68.4 18.7,68.4 16.4,70.7 16.4,76.4 8.3,84.5 2.4,84.5 v1.6,83.7
PTI_FRAME  (via drill 0.2)
  Top 0.15: X2.9 7.14,83.5 v5.3,83.5 | v17.3,68.2 17.8,67.7 U$1.P$28
  Bottom 0.15: v5.3,83.5 8.8,83.5 16,76.3 16,69.5 v17.3,68.2
RESET
  Top 0.15: X2.3 9.07,79.73 12.72,76.08 R2.1 12.72,70.22 U$1.P$1
RST
  Top 0.15: U11.3 16.4,33.3 16.5,33.2 48.4,33.2 50.6,31 55.08,31 | 54.99,32.69 54.99,32.29
  Top 0.152: 54.98,32.3 54.99,32.29 RESET.2 55.08,31 55.08,30.82 55.83,30.07 R15.1 56.37,29.84 U28.3
  Top 0.2: C25.1 55.08,32.6 RESET.2
RTS
  Top 0.15: 15.6,30.8 15.7,30.8 16.1,30.4 U9.24 | 15.6,30.8 16.1,31.3 U11.2 | R9.1 14.45,30.8 14.48,30.83 14.92,30.83 14.95,30.8 15.6,30.8
RXD  (via drill 0.2)
  Top 0.15: U9.26 15.1,29.81 14.93,29.98 14.93,30.07 v14.7,30.3
  Top 0.152: v53.5,13.61 53.83,13.28 U28.34
  Bottom 0.152: v53.5,13.61 48.99,13.61 31.9,30.7 15.71,30.7 15.68,30.73 15.13,30.73 v14.7,30.3
SCK  (via drill 0.2)
  Top 0.15: v48.5,9 48.75,9.25 U28.30
  Bottom 0.15: SV1.7 43.66,9.43 48.07,9.43 v48.5,9
SDI  (via drill 0.2)
  Top 0.15: v57.5,9.1 57.5,10.86 U28.37
  Bottom 0.15: SV1.6 41.59,9.9 54.9,9.9 55.8,9 57.4,9 v57.5,9.1
SWCLK  (via drill 0.2)
  Top 0.15: U$1.P$13 13.83,64.67 v13.83,64.1 | X2.8 5.23,82.27 v5.3,82.2
  Bottom 0.15: v13.83,64.1 13.83,65.18 14.13,65.48 14.13,75.97 7.85,82.25 5.35,82.25 v5.3,82.2
SWDIO  (via drill 0.2)
  Top 0.15: X2.7 8.63,82.27 v8.9,82 | v14.7,65.7 14.7,65.42 14.2,64.92 U$1.P$14
  Bottom 0.15: v8.9,82 14.7,76.2 v14.7,65.7
SWO  (via drill 0.2)
  Top 0.15: U$1.P$15 14.7,64.9 14.85,65.05 14.85,65.07 15.28,65.5 v15.46,65.5 | v2,81 X2.6
  Bottom 0.15: v15.46,65.5 15.43,65.53 15.43,76.22 8.85,82.8 3.8,82.8 v2,81
T_CLK  (via drill 0.2)
  Top 0.15: SV1.10 44.85,3.85 39.83,8.87 v39.7,8.87 | v38.9,21.9 38.9,25.7 39.6,26.4 43,26.4 43.67,27.07 U28.13
  Bottom 0.15: v39.7,8.87 38.9,9.67 v38.9,21.9
T_CS
  Top 0.15: SV1.11 47.39,5.31 44.94,7.76 U28.27
T_DI  (via drill 0.2)
  Top 0.15: U28.16 39.84,23.95 39.43,23.53 39.43,21.48 38.72,20.77 37.6,20.77 v37.6,20.7 | v38.8,7.9 41.6,5.1 42.85,5.1 v42.88,5.08
  Bottom 0.15: v37.6,20.7 37.63,20.67 37.63,8.97 38.7,7.9 v38.8,7.9 | v42.88,5.08 42.98,4.97 49.43,4.97 49.9,4.5 49.9,2.4 49.8,2.3 49.8,2.87 SV1.12
T_DO  (via drill 0.2)
  Top 0.15: U28.14 41.1,26.7 39.27,26.7 38.3,25.73 v38.3,22.5 | v38.6,9.2 38.8,9.4 40.1,9.4 44,5.5 v46,5.5
  Bottom 0.15: v38.3,22.5 38.3,9.5 v38.6,9.2 | v46,5.5 51.1,5.5 52.47,4.13 SV1.13
T_IRQ
  Top 0.15: SV1.14 49.64,8.37 46.88,8.37 46.27,8.98 46.27,10.94 U28.28
TS
  Top 0.15: U4.1 6.25,15.72 R7.2
TXD  (via drill 0.2)
  Top 0.15: U9.25 15.56,29.31 15.56,30.1 v15.46,30.2
  Top 0.152: U28.35 55,11.1 v55,12.6
  Bottom 0.152: v15.46,30.2 15.96,29.7 32.1,29.7 48.8,13 54.6,13 v55,12.6
VBAT  (via drill 0.45)
  Top 0.813: U4.2 4.53,14.97 4.5,15 v4.55,15.05 | v19.9,42.5 23.9,38.5 E1.PAD
  Bottom 0.813: v4.55,15.05 1,18.6 1,42.1 3.1,44.2 18.2,44.2 v19.9,42.5
VBUS
  Top 0.2: J1.A4B9 9.35,29.25 10.1,28.5 U12.1 U12.10
  pour Top: 7.5,24.6 10.3,24.6 11,23.9 11,23 11.3,22.7 11.4,22.6 12.2,22.6 12.5,22.3 12.5,21.5 12.4,21.4 9.7,21.4 9.5,21.6 9.5,23.2 9.5,23.5 8.9,24.1 7.5,24.1
  pour Top: 8.8,29.5 5.7,29.5 5,28.8 5,24.5 5.4,24.1 7.8,24.1 7.9,24.2 7.9,24.6 7.1,24.6 6.1,25.6 6.1,27.9 7.2,29 8.8,29
VDD  (via drill 0.2, 0.25, 0.3)
  Top 0.15: R2.2 11.88,72.47 v11.9,72.5
  Top 0.2: R12.2 R13.2 9,11.47 v9,10.7
  Top 0.203: R11.1 v16.7,23.5 | U9.6 U9.7 12.35,25.5 C36.1 11.05,25.15 v10.7,25.5
  Top 0.254: U$1.P$25 18.6,66.4 | 18.6,66.4 U$1.P$26 18.98,66.33 C3.2 | 18.6,66.4 18.68,66.33 C3.2 | C3.2 v19.7,65.4 | C3.2 20.98,66.33 C1.2 | X2.1 7.24,78.4 v8.9,78.4
  Top 0.406: U28.2 57.73,28.09 C4.2 57.73,30.88 57.67,30.93 | 57.67,30.93 v57.6,31 57.6,31.75 C2.2 | R15.2 57.67,30.93
  Route15 0.2: v9,10.7 11.6,8.1 11.8,8.1
  other vias: 8.2,4.3 0.6,5.3 1.3,5.8 1.3,4.7 0.6,4.1 1.2,3.3 0.6,2.5 1.3,1.9 0.8,1.1 1.7,1 2.4,1.6 8.1,2.5 8.2,3.4 9,3.6 9.7,4.2 9,4.6 9.6,5.3
  pour Top: 0.8,6.5 3.4,6.5 3.5,6.4 3.5,5.4 3.1,5 3.1,1.6 2.8,1.3 1.5,0 1,0 0,1 0,5.7
  pour Top: 6.6,1.9 6.6,5 6.1,5.5 6.1,6.4 7.7,6.4 7.9,6.2 7.9,5.8 8.1,5.6 8.8,5.6 9.2,6 9.3,6.1 9.3,6.5 9.8,6.5 10.2,6.1 10.2,4 8.1,1.9
  pour Route15: 0.8,7.1 10.2,7.1 16,12.9 16,16.4 12.2,20.2 9.8,22.6 9.8,30 9.8,64.4 11.8,66.4 13.2,67.8 13.2,69.4 11.4,71.2 11.4,72.4 6.9,76.9 1.8,76.9 0.1,78.6 0.1,88.7 0.1,90.1 1.2,91.2 33,91.2 37,87.2 37,40.9 37.9,40 64.5,40 67,37.5 67,1 65.9,-0.1 1.1,-0.1 0,1 0,6.3
VIN
  pour Top: 9.3,16.1 9.3,18.7 9.5,18.9 9.6,19 11.9,19 12.2,19 12.3,18.9 12.3,18.5 12,18.2 10.6,18.2 10.4,18 10.4,16.3 10.2,16.1
VPROC  (via drill 0.3)
  Top 0.305: U4.10 13.12,14.97 13.4,14.7
  other vias: 1.5,11 1.3,11.9 1.4,12.8 2.2,13.3 3.3,13.4 4.4,13.4 5.4,13.4 6.4,13.4 13.1,14.1 13.7,14.7 12.8,14.8
  pour Top: 6.1,10 7.7,10 8,10.3 8,13.8 1.9,13.8 1,12.9 1,10.8 1.8,10 3.5,10 3.5,10.9 3.2,11.2 3.2,12.8 3.4,13 6.1,13 6.4,12.7 6.4,11.1 6.1,10.8
  pour Top: 1.9,9.4 1.9,10.2 2.8,10.2 2.8,9.4
  pour Top: 9.8,14.7 9.8,15.2 13.5,15.2 13.9,14.8 13.9,14 13.7,13.8 12.9,13.8 12.4,14.3 11.4,14.3 11,14.7
  pour Route15: 1,10.8 1,13.3 1.7,14 11.3,14 12.5,15.2 13.7,15.2 14.1,14.8 14.1,14.1 13.7,13.7 10.6,10.6 1.1,10.6 1,10.7